# EAGLE design LSM303D (EAGLE 7.1.0)
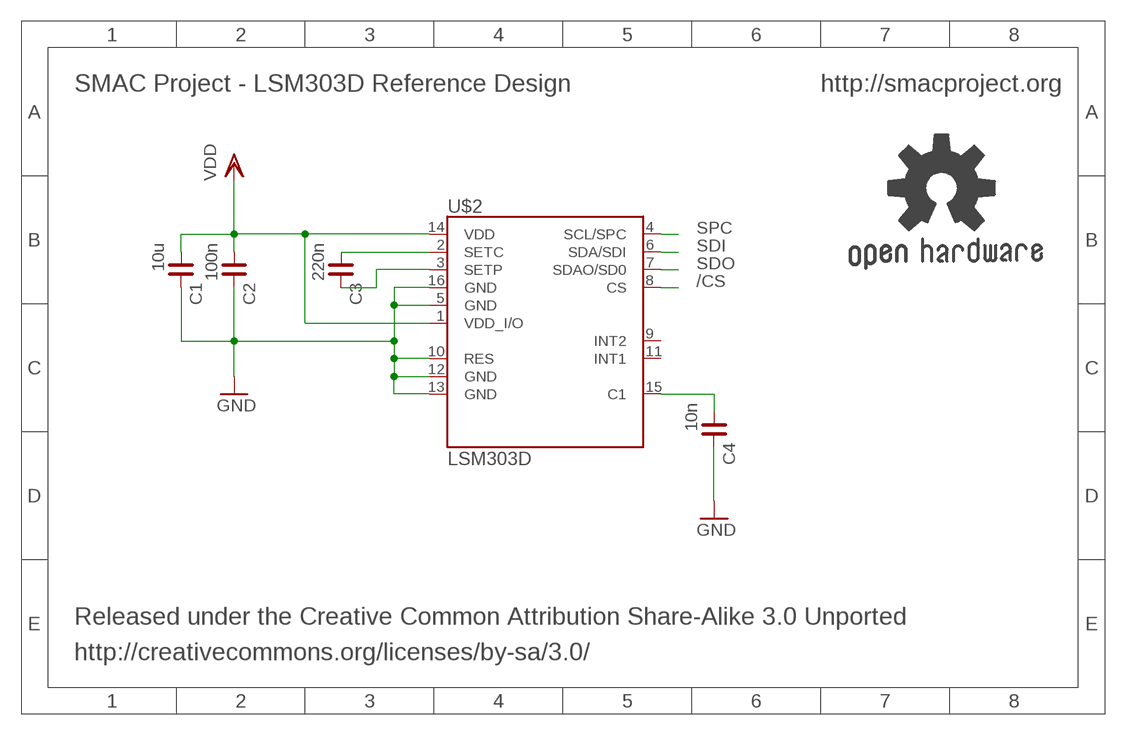
[diagram p0: schematic, sheet 1]

## Parts
C1  10u  C_0402  [C0402]
C2  100n  C_0402  [C0402]
C3  220n  C_0402  [C0402]
C4  10n  C_0402  [C0402]
GOLD_ORB_SM2  OSHWLOGO_REF_SM  [OSHW2REF]
U$2  LSM303D  [LGA16-3MM]

## Nets
/CS: U$2.8(CS)
GND: C1.2 C2.2 C4.2 U$2.5(GND) U$2.10(RES) U$2.12(GND) U$2.13(GND) U$2.16(GND)
N$2: C3.1 U$2.2(SETC)
N$10: C4.1 U$2.15(C1)
N$11: C3.2 U$2.3(SETP)
SDI: U$2.6(SDA/SDI)
SDO: U$2.7(SDAO/SD0)
SPC: U$2.4(SCL/SPC)
VDD: C1.1 C2.1 U$2.1(VDD_I/O) U$2.14(VDD)
Unconnected: U$2.9(INT2) U$2.11(INT1)

## Notes on the sheet
- SMAC Project - LSM303D Reference Design | http://smacproject.org
- Released under the Creative Common Attribution Share-Alike 3.0 Unported
- http://creativecommons.org/licenses/by-sa/3.0/

## Library data of the parts
C1-C4 = rc-master-smd:C_: NON-POLARIZED CAP
GOLD_ORB_SM2 = bfl:OSHWLOGO: These are Open-Source Hardware logos.
U$2 = SparkFun-Sensors:LSM303D

## Board
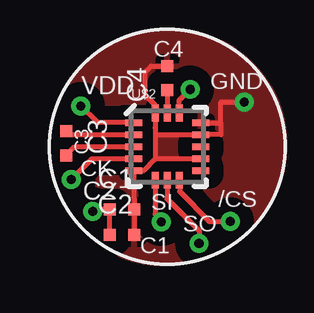
[diagram p1: board, top side]
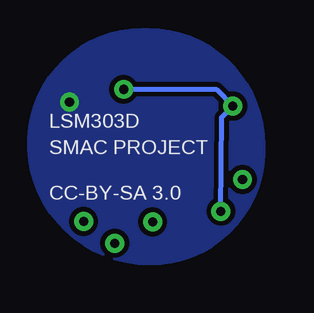
[diagram p2: board, bottom side, seen from below]

No outline drawn. Coordinates in mm, seen from the top.
Copper layers (1*16): Top 0.035mm / dielectric 1.5mm / Bottom 0.035mm
Design rules "default": minimum track width 10mil, minimum drill 0.6mm, track to track 8mil, track to pad 8mil, pad to pad 8mil, via to via 8mil, smd to smd 8mil, copper to edge 40mil, drill to drill 8mil, minimum pad ring 10mil, minimum via ring 8mil, stop-mask expansion 4mil, vias tented up to drill 0mil, thermal gap 10mil

### Footprints (pad centres in the part's own frame; a part is rotated, then mirrored left to right if it is on the bottom)
C0402 = smd 0.5 x 0.5: 1 -0.508,0; 2 0.508,0
LGA16-3MM = smd 0.7 x 0.28: 1 -1.4,1; 2 -1.4,0.5; 3 -1.4,0; 4 -1.4,-0.5; 5 -1.4,-1; 9 1.4,-1; 10 1.4,-0.5; 11 1.4,0; 12 1.4,0.5; 13 1.4,1 | smd 0.28 x 0.7: 6 -0.5,-1.4; 7 0,-1.4; 8 0.5,-1.4; 14 0.5,1.4; 15 0,1.4; 16 -0.5,1.4

### Placement (x,y rotation side)
C1  -1.88,-2.61 0 top
C2  -1.89,-3.68 0 top
C3  -4.22,0.14 270 top
C4  0,2.86 90 top
GOLD_ORB_SM2  6.66,-3.46 0 top
U$2  0,0 0 top

### Tracks (layer width: path | path; a pad name or v marks a point on that pad's centre or on a via)
/CS  (via drill 0.38)
  Top 0.2: U$2.8 0.52,-1.42 0.52,-1.88 1.76,-3.12 v2.62,-3.12
GND  (via drill 0.38)
  Top 0.2: C1.2 -1.38,-2.63 C2.2 | C1.2 -1.4,-2.58 | U$2.5 | C1.2 -1.37,-2.17 -1.37,-1.03 arc90 U$2.5 | -1.42,-1.02 arc90 U$2.5 | U$2.16 -0.49,-0.09 -0.49,-0.52 | -0.49,-0.52 -0.47,-0.5 U$2.10 | U$2.13 1.42,0.98 2.23,0.98 | 2.23,0.98 2.23,0.5 U$2.12 -0.5,0.5 -0.5,0.78 U$2.16 | U$2.5 -1,-0.99 -0.96,-0.99 -0.49,-0.52 | U$2.16 -0.5,1.74 -0.92,2.16 -0.92,3.13 -0.67,3.37 C4.2 | 2.23,0.98 2.23,1.86 v3.21,1.86
  pour Bottom: -4.88,0.07 arc-90 -0.07,4.89 0.17,4.89 arc-98 4.87,-0.55 arc-82 -0.13,-4.89 arc-93 -4.89,0.11
  pour Top (isolate 0.6): -4.86,0.03 arc-90 -0.04,4.84 0.19,4.84 arc-98 4.9,-0.59 arc-82 -0.1,-4.93 arc-93 -4.87,0.07
N$2
  Top 0.2: C3.1 -4.07,0.5 U$2.2
N$10
  Top 0.2: C4.1 U$2.15
N$11
  Top 0.2: C3.2 -3.85,0 U$2.3
SDI  (via drill 0.38)
  Top 0.2: U$2.6 -0.5,-2.82 v-0.25,-3.14
SDO  (via drill 0.38)
  Top 0.2: U$2.7 0,-2.18 1.05,-3.23 1.32,-3.51 v1.32,-4.03
SPC  (via drill 0.38)
  Top 0.2: v-4,-1.37 -3.13,-0.5 U$2.4
VDD  (via drill 0.38)
  Top 0.2: C2.1 -2.39,-3.67 C1.1 -3.02,-2.61 v-3.1,-2.7 | U$2.1 -2.9,1 v-3.6,1.7 | U$2.14 0.5,1.94 v0.95,2.39
  Bottom 0.2: v0.95,2.39 -2.9,2.39 v-3.6,1.7 -3.13,1.23 v-3.1,-2.7

### Text on the board
tPlace: C4 | VDD | GND | C3 | CK | C2 | SI | /CS | C1 | SO
bPlace: LSM303D | SMAC PROJECT | CC-BY-SA 3.0
Reference: http://smacproject.org